# Altium schematic sheet STM.SchDoc: MICROCONTROLLER
size A; SheetNumber: 2; SheetTotal: 4
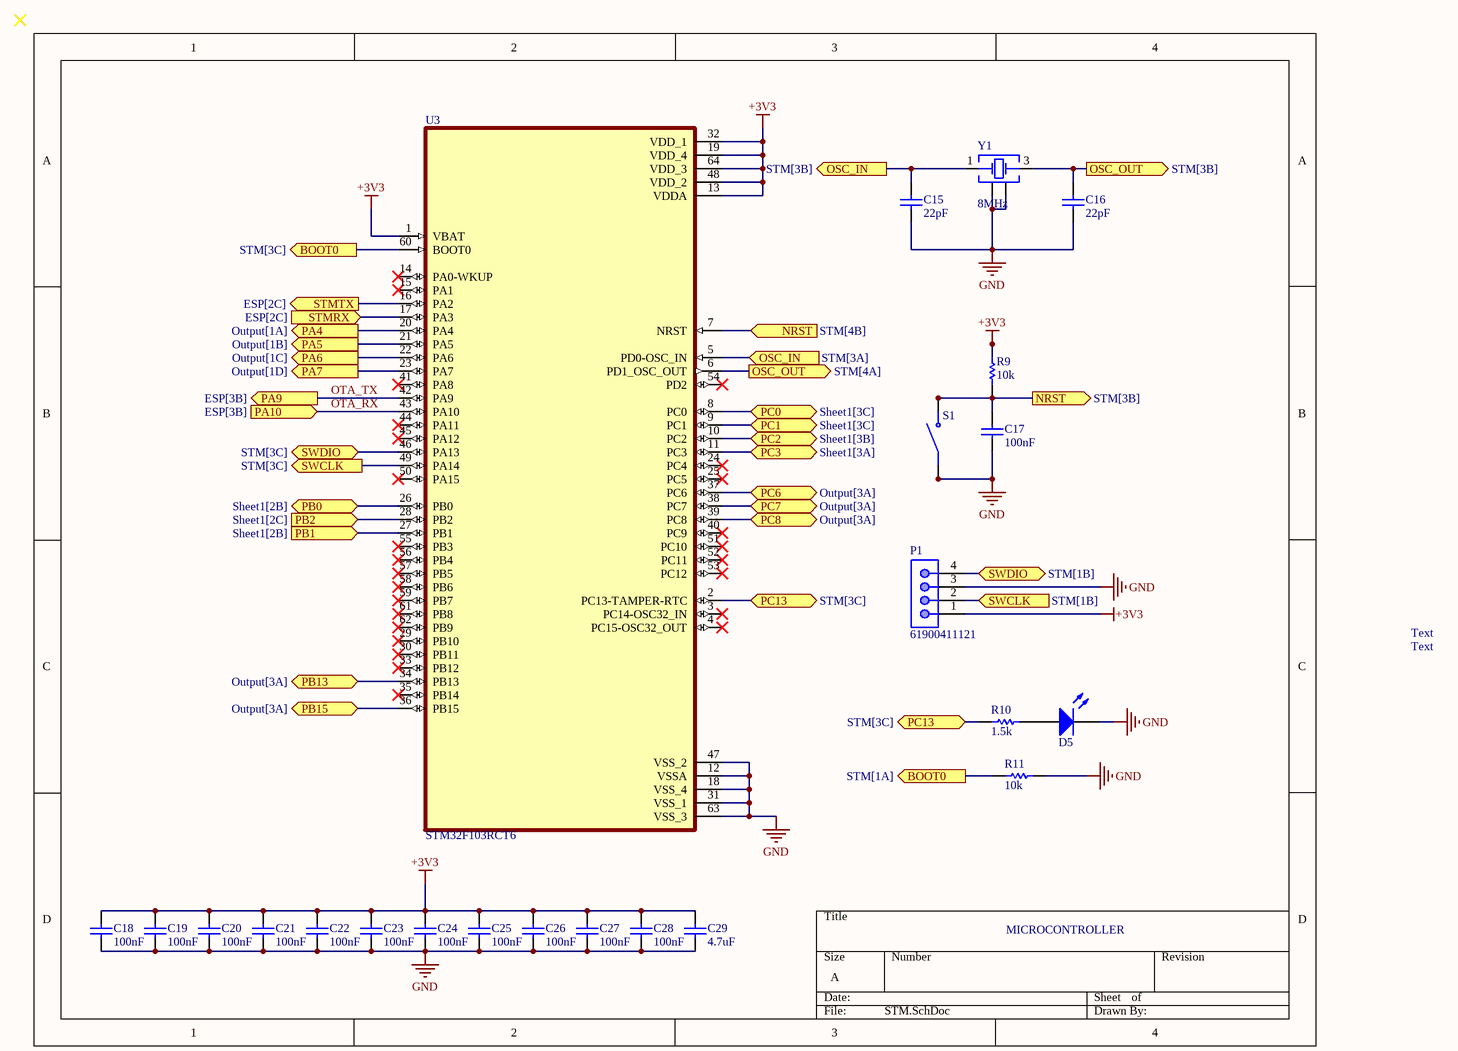
[diagram p0: STM.SchDoc]

## Parts
C15  22pF  [CAP_0603]
C16  22pF  [CAP_0603]
C17  100nF  [CAP_0603]
C18  100nF  [CAP_0603]
C19  100nF  [CAP_0603]
C20  100nF  [CAP_0603]
C21  100nF  [CAP_0603]
C22  100nF  [CAP_0603]
C23  100nF  [CAP_0603]
C24  100nF  [CAP_0603]
C25  100nF  [CAP_0603]
C26  100nF  [CAP_0603]
C27  100nF  [CAP_0603]
C28  100nF  [CAP_0603]
C29  4.7uF  [CAP_0603]
D5  LED SMD  [LED_0805_Blue]  (value not drawn)
P1  61900411121  [61900411121]
R9  10k  [resistor_0603]
R10  1.5k  [resistor_0603]
R11  10k  [resistor_0603]
S1  (no value)  [SW_8-1437565-1]
U3  STM32F103RCT6  [QFP50P1200X1200X160-64N]
Y1  8MHz  [WE-XTAL_CFPX-104]

## Ports
BOOT0 (out, see STM[1A]), BOOT0 (out, see STM[3C]), NRST (in, see STM[4B]), NRST (out, see STM[3B]), OSC_IN (in, see STM[3A]), OSC_IN (out, see STM[3B]), OSC_OUT (out, see STM[3B]), OSC_OUT (out, see STM[4A]), PA4 (out, see Output[1A]), PA5 (out, see Output[1B]), PA6 (out, see Output[1C]), PA7 (out, see Output[1D]), PA9 (out, see ESP[3B]), PA10 (in, see ESP[3B]), PB0 (bidir, see Sheet1[2B]), PB1 (in, see Sheet1[2B]), PB2 (in, see Sheet1[2C]), PB13 (bidir, see Output[3A]), PB15 (bidir, see Output[3A]), PC0 (bidir, see Sheet1[3C]), PC1 (bidir, see Sheet1[3C]), PC2 (bidir, see Sheet1[3B]), PC3 (bidir, see Sheet1[3A]), PC6 (bidir, see Output[3A]), PC7 (bidir, see Output[3A]), PC8 (bidir, see Output[3A]), PC13 (bidir, see STM[3C]), STMRX (in, see ESP[2C]), STMTX (out, see ESP[2C]), SWCLK (in, see STM[1B]), SWCLK (out, see STM[3C]), SWDIO (bidir, see STM[1B]), SWDIO (bidir, see STM[3C])

## Nets
+3V3: C18.2 C19.2 C20.2 C21.2 C22.2 C23.1 C24.2 C25.2 C26.2 C27.2 C28.2 C29.2 P1.1 R9.2 U3.1(VBAT) U3.13(VDDA) U3.19(VDD_4) U3.32(VDD_1) U3.48(VDD_2) U3.64(VDD_3)
GND: C15.1 C16.1 C17.1 C18.1 C19.1 C20.1 C21.1 C22.1 C23.2 C24.1 C25.1 C26.1 C27.1 C28.1 C29.1 D5.2(K) P1.3 R11.2 S1.1(COM) S1.2(COM) U3.12(VSSA) U3.18(VSS_4) U3.31(VSS_1) U3.47(VSS_2) U3.63(VSS_3) Y1.2(GND) Y1.4(GND)
BOOT0: R11.1 U3.60(BOOT0) ; port BOOT0
NRST: C17.2 R9.1 S1.3(NO) S1.4(NO) U3.7(NRST) ; port NRST
OSC_IN: C15.2 U3.5(PD0-OSC_IN) Y1.1(OSC1) ; port OSC_IN
OSC_OUT: C16.2 U3.6(PD1_OSC_OUT) Y1.3(OSC2) ; port OSC_OUT
OTA_RX: U3.43(PA10) ; port PA10
OTA_TX: U3.42(PA9) ; port PA9
PA4: U3.20(PA4) ; port PA4
PA5: U3.21(PA5) ; port PA5
PA6: U3.22(PA6) ; port PA6
PA7: U3.23(PA7) ; port PA7
PB0: U3.26(PB0) ; port PB0
PB1: U3.27(PB1) ; port PB1
PB2: U3.28(PB2) ; port PB2
PB13: U3.34(PB13) ; port PB13
PB15: U3.36(PB15) ; port PB15
PC0: U3.8(PC0) ; port PC0
PC1: U3.9(PC1) ; port PC1
PC2: U3.10(PC2) ; port PC2
PC3: U3.11(PC3) ; port PC3
PC6: U3.37(PC6) ; port PC6
PC7: U3.38(PC7) ; port PC7
PC8: U3.39(PC8) ; port PC8
PC13: R10.2 U3.2(PC13-TAMPER-RTC) ; port PC13
STMRX: U3.17(PA3) ; port STMRX
STMTX: U3.16(PA2) ; port STMTX
SWCLK: P1.2 U3.49(PA14) ; port SWCLK
SWDIO: P1.4 U3.46(PA13) ; port SWDIO
NetD5_1: D5.1(A) R10.1

Not connected (* = marked no-connect by the designer): U3 3(PC14-OSC32_IN)* 4(PC15-OSC32_OUT)* 14(PA0-WKUP)* 15(PA1)* 24(PC4)* 25(PC5)* 29(PB10)* 30(PB11)* 33(PB12)* 35(PB14)* 40(PC9)* 41(PA8)* 44(PA11)* 45(PA12)* 50(PA15)* 51(PC10)* 52(PC11)* 53(PC12)* 54(PD2)* 55(PB3)* 56(PB4)* 57(PB5)* 58(PB6)* 59(PB7)* 61(PB8)* 62(PB9)*

## Notes on the sheet
- Text

## Library data of the parts
C15 C16 = 01060322010: CAP, size 0603, 22pF; Supply 2 name: Thegioiic; Capacitance Tolerance: +/-10%; ComponentLink1Description: Manufacturer; ComponentLink1URL: Thegioiic; ComponentLink2Description: Datasheet; ComponentLink2URL: *; Operating Temperature: -55 to +125degC; Packaging: Tape and Reel; Supply 1 SN: *; Supply 1 name: *; Supply 1 URL: *; Supply 2 SN: *; Supply 2 URL: https://www.thegioiic.com/tu-gom-0603-22pf-50v; *: *; Height: *; Mounting Technology: SMT; Size: 0603; Capacitance: 22pF; Technical Reference: *
C17-C28 = 01060310410: CAP, size 0603, 100nF; Supply 1 SN: 885012206095; Supply 1 name: Wurth Elektronik; Supply 2 name: Thegioiic; Capacitance Tolerance: +/-10%; ComponentLink1Description: Manufacturer; ComponentLink1URL: http://www.we-online.de; ComponentLink2Description: Datasheet; ComponentLink2URL: https://www.we-online.com/catalog/datasheet/885012206095.pdf; Operating Temperature: -55 to +125degC; Packaging: Tape and Reel; Supply 1 URL: https://www.we-online.com/en/components/products/WCAP-CSGP-50VDC?sq=885012206095R#885012206095R; Supply 2 SN: *; Supply 2 URL: https://www.thegioiic.com/tu-gom-0603-100nf-0-1uf-50v; Dissipation Factor: *; Height: *; Mounting Technology: SMT; Size: 0603; Capacitance: 100nF; Technical Reference: *
C29 = 01060310510: CAP, size 0603, 1uF; Supply 1 SN: 885012206126; Supply 1 name: Wurth Elektronik; Supply 2 name: Thegioiic; Capacitance Tolerance: +/-10%; ComponentLink1Description: Manufacturer; ComponentLink1URL: http://www.we-online.de; ComponentLink2Description: Datasheet; ComponentLink2URL: https://www.we-online.com/components/products/datasheet/885012206126.pdf; Operating Temperature: -55 to +125degC; Packaging: Tape and Reel; Supply 1 URL: https://www.we-online.com/en/components/products/WCAP-CSGP-50VDC?sq=885012206126#885012206126; Supply 2 SN: *; Supply 2 URL: https://www.thegioiic.com/tu-gom-0603-1uf-50v; Dissipation Factor: *; Height: *; Mounting Technology: SMT; Size: 0603; Capacitance: 1uF; Technical Reference: *
D5 = LED SMD: LED
P1 = 61900411121: WR-WTB THT Male Vertical Locking Header, pitch 2.54mm, 4p; Pin Number: 4; Contact Resistance: 20mOhm; Rated Current: 3A; Withstanding Voltage: 1000VAC; Working Voltage: 250VAC; ComponentLink1Description: Manufacturer; ComponentLink1URL: http://www.we-online.de; ComponentLink2Description: Datasheet; ComponentLink2URL: https://www.we-online.com/catalog/datasheet/61900411121.pdf; Pitch: 2.54mm; Published Date: January 2020; Publisher: Wurth Elektronik; Mounting Technology: THT; Packaging: Bag; Operating Temperature: -40 to +105degC; Part Number: 61900411121; Gender: Male; Type: Vertical
R9 R11 = 0006031031: RES, 10k Ohm, size 0603, 1%; Resistance Tolerant: +/-1%; Rated Power: 1/4W; Supply 1 Name: Mouser; Supply 1 SN: 755-ESR03EZPF1002; Supply 2 Name: Digikey; Supply 2 SN: RHM10KADTR-ND RHM10KADCT-ND RHM10KADDKR-ND; Resistance: 10k; Size: 0603; Mounting Technology: SMT; ComponentLink1Description: Datasheet link; ComponentLink1URL: https://fscdn.rohm.com/en/products/databook/datasheet/passive/resistor/chip_resistor/esr-e.pdf; ComponentLink2Description: Supply 1 URL; ComponentLink2URL: https://www.mouser.vn/ProductDetail/ROHM-Semiconductor/ESR03EZPF1002?qs=sGAEpiMZZMvdGkrng054t67Efho1F8r6CDeAsqwFse8%3D; ComponentLink3Description: Supply 2 URL; ComponentLink3URL: https://www.digikey.com/en/products/detail/rohm-semiconductor/ESR03EZPF1002/1983429
R10 = 0006031521: RES, 1.5 kOhms, size 0603, 1%; Resistance tolerance: +/-1%; Rated Power: 1/4 W; Supply 1 Name: Mouser; Supply 1 SN: 755-SFR03EZPF1501; Supply 2 Name: Digi-Key; Supply 2 SN: 13-RC0603FR-071R5LTR-ND; Size: 0603; Mounting Technology: SMT; Resistance: 1.5 k; ComponentLink1Description: Datasheet link; ComponentLink1URL: *; Supply 1 URL: https://www.mouser.vn/ProductDetail/ROHM-Semiconductor/SFR03EZPF1501?qs=byeeYqUIh0NryWvnzlukLQ%3D%3D; Supply 2 URL: https://www.digikey.com/en/products/detail/yageo/RC0603FR-071R5L/5918292; Supply 3 Name: *; Supply 3 SN: *
S1 = 8-1437565-1: Package: None; MP: 8-1437565-1; Price: None; Availability: Unavailable; Value: *
U3 = STM32F103RCT6: ARMÂ® CortexÂ®-M3 STM32F1 Microcontroller IC 32-Bit 72MHz 256KB (256K x 8) FLASH 64-LQFP (10x10); MF: STMicroelectronics; Value: *; SnapEDA_Link: https://www.snapeda.com/parts/STM32F103RCT6/STMicroelectronics/view-part/?ref=snap; MP: STM32F103RCT6; Purchase-URL: https://pricing.snapeda.com/search/part/STM32F103RCT6/?ref=eda; Check_prices: https://www.snapeda.com/parts/STM32F103RCT6/STMicroelectronics/view-part/?ref=eda; Availability: In Stock; Price: None; Package: LQFP-64 STMicroelectronics
Y1 = 830106162701: WE-XTAL Quartz Crystal, SMT, CFPX-104, 8MHz, +/-20ppm; Manufacturer: Wurth Elektronik; Frequency Stability: +/-30ppm; Load Capacitance: 16pF; ComponentLink1Description: Manufacturer; ComponentLink1URL: http://www.we-online.de; ComponentLink2Description: Datasheet; ComponentLink2URL: https://www.we-online.com/catalog/datasheet/830106162701.pdf; Operating Temperature: -40 to +85degC; Packaging: Tape and Reel; Manufacturer Part Number: 830106162701; Published Date: November 2020; Size: CFPX-104; Frequency: 8MHz; Frequency Tolerance: +/-20ppm; Mounting Technology: SMT